# Altium schematic sheet P[11]_CPU_IO.SchDoc
size 513 x 386 mm
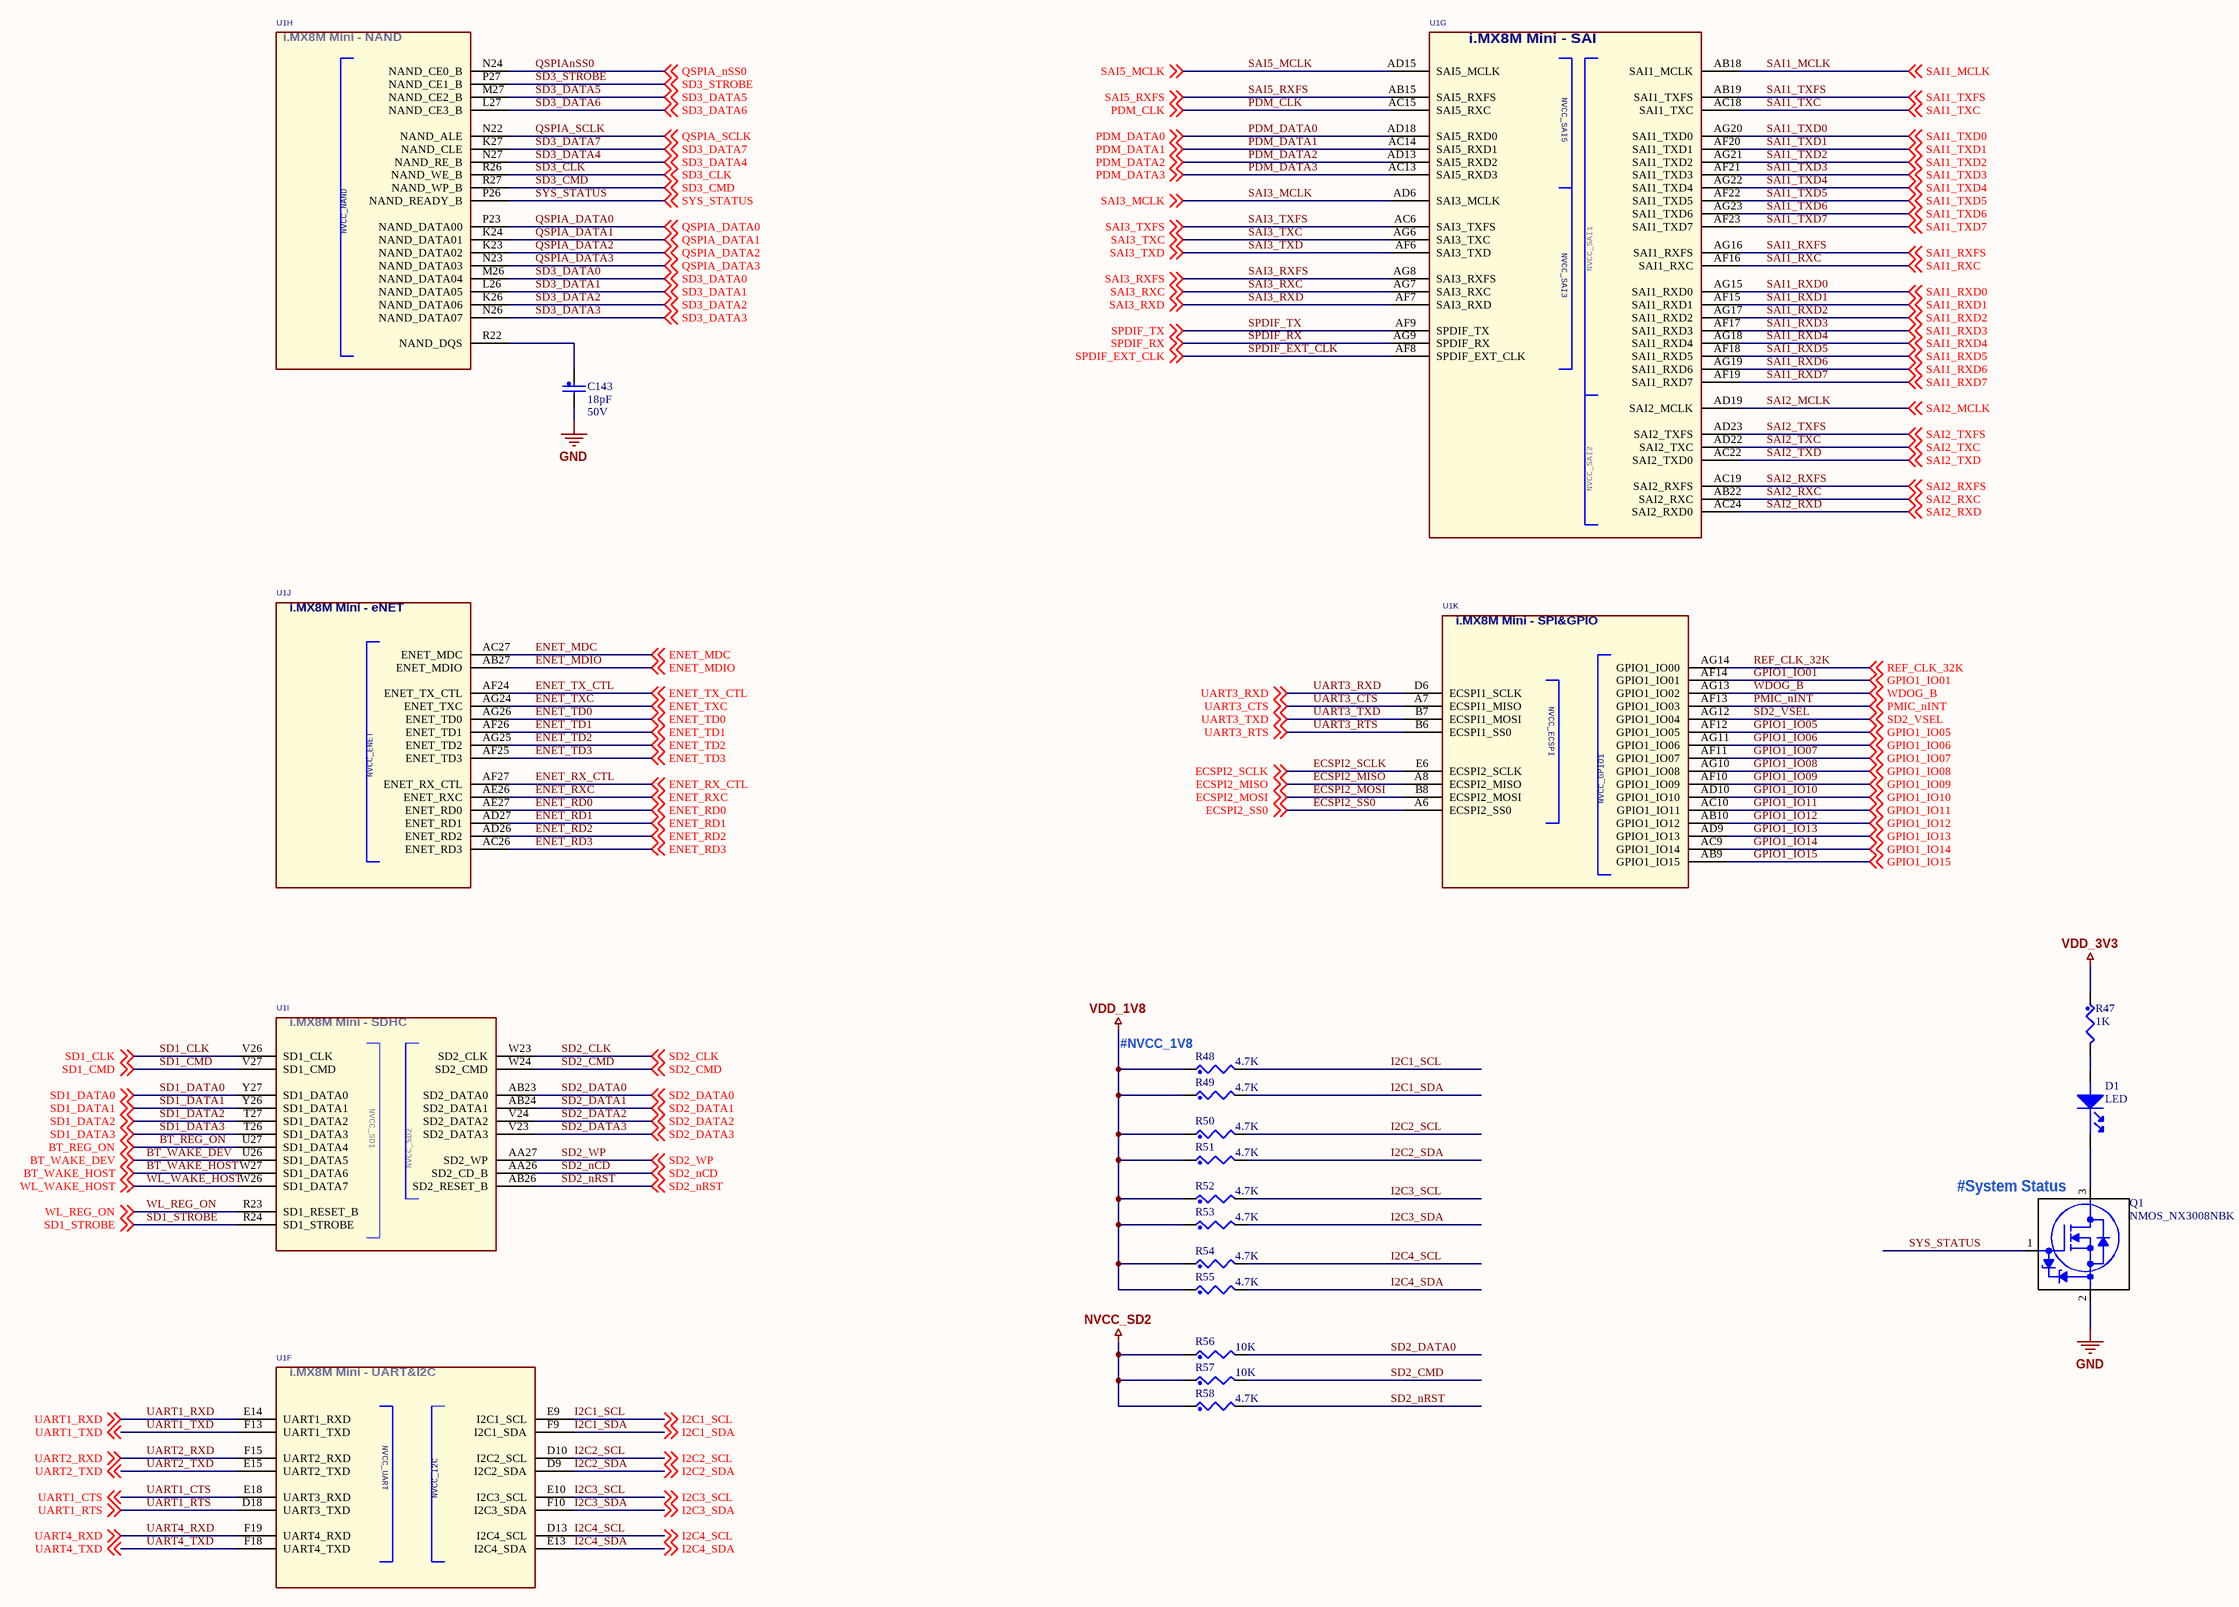
[diagram p0: P[11]_CPU_IO.SchDoc]

## Parts
C143  18pF  Voltage: 50V  [0201_CC - C]
D1  LED  [LED_0603]
Q1  NMOS_NX3008NBK  [SOT65P210X110-3N]
R47  1K  [0201_CC]
R48  4.7K  [0201_CC]
R49  4.7K  [0201_CC]
R50  4.7K  [0201_CC]
R51  4.7K  [0201_CC]
R52  4.7K  [0201_CC]
R53  4.7K  [0201_CC]
R54  4.7K  [0201_CC]
R55  4.7K  [0201_CC]
R56  10K  [0201_CC]
R57  10K  [0201_CC]
R58  4.7K  [0201_CC]
U1  (no value)  [BGA486_0P5_14X14]  (parts F,G,H,I,J,K of 14)

## Nets
GND: C143.2 Q1.2(SOURCE)
NVCC_SD2: R56.1 R57.1 R58.1
VDD_1V8: R48.1 R49.1 R50.1 R51.1 R52.1 R53.1 R54.1 R55.1
VDD_3V3: R47.1
BT_REG_ON: U1.U27(SD1_DATA4) ; off-sheet BT_REG_ON
BT_WAKE_DEV: U1.U26(SD1_DATA5) ; off-sheet BT_WAKE_DEV
BT_WAKE_HOST: U1.W27(SD1_DATA6) ; off-sheet BT_WAKE_HOST
ECSPI2_MISO: U1.A8(ECSPI2_MISO) ; off-sheet ECSPI2_MISO
ECSPI2_MOSI: U1.B8(ECSPI2_MOSI) ; off-sheet ECSPI2_MOSI
ECSPI2_SCLK: U1.E6(ECSPI2_SCLK) ; off-sheet ECSPI2_SCLK
ECSPI2_SS0: U1.A6(ECSPI2_SS0) ; off-sheet ECSPI2_SS0
ENET_MDC: U1.AC27(ENET_MDC) ; off-sheet ENET_MDC
ENET_MDIO: U1.AB27(ENET_MDIO) ; off-sheet ENET_MDIO
ENET_RD0: U1.AE27(ENET_RD0) ; off-sheet ENET_RD0
ENET_RD1: U1.AD27(ENET_RD1) ; off-sheet ENET_RD1
ENET_RD2: U1.AD26(ENET_RD2) ; off-sheet ENET_RD2
ENET_RD3: U1.AC26(ENET_RD3) ; off-sheet ENET_RD3
ENET_RX_CTL: U1.AF27(ENET_RX_CTL) ; off-sheet ENET_RX_CTL
ENET_RXC: U1.AE26(ENET_RXC) ; off-sheet ENET_RXC
ENET_TD0: U1.AG26(ENET_TD0) ; off-sheet ENET_TD0
ENET_TD1: U1.AF26(ENET_TD1) ; off-sheet ENET_TD1
ENET_TD2: U1.AG25(ENET_TD2) ; off-sheet ENET_TD2
ENET_TD3: U1.AF25(ENET_TD3) ; off-sheet ENET_TD3
ENET_TX_CTL: U1.AF24(ENET_TX_CTL) ; off-sheet ENET_TX_CTL
ENET_TXC: U1.AG24(ENET_TXC) ; off-sheet ENET_TXC
GPIO1_IO01: U1.AF14(GPIO1_IO01) ; off-sheet GPIO1_IO01
GPIO1_IO05: U1.AF12(GPIO1_IO05) ; off-sheet GPIO1_IO05
GPIO1_IO06: U1.AG11(GPIO1_IO06) ; off-sheet GPIO1_IO06
GPIO1_IO07: U1.AF11(GPIO1_IO07) ; off-sheet GPIO1_IO07
GPIO1_IO08: U1.AG10(GPIO1_IO08) ; off-sheet GPIO1_IO08
GPIO1_IO09: U1.AF10(GPIO1_IO09) ; off-sheet GPIO1_IO09
GPIO1_IO10: U1.AD10(GPIO1_IO10) ; off-sheet GPIO1_IO10
GPIO1_IO11: U1.AC10(GPIO1_IO11) ; off-sheet GPIO1_IO11
GPIO1_IO12: U1.AB10(GPIO1_IO12) ; off-sheet GPIO1_IO12
GPIO1_IO13: U1.AD9(GPIO1_IO13) ; off-sheet GPIO1_IO13
GPIO1_IO14: U1.AC9(GPIO1_IO14) ; off-sheet GPIO1_IO14
GPIO1_IO15: U1.AB9(GPIO1_IO15) ; off-sheet GPIO1_IO15
I2C1_SCL: R48.2 U1.E9(I2C1_SCL) ; off-sheet I2C1_SCL
I2C1_SDA: R49.2 U1.F9(I2C1_SDA) ; off-sheet I2C1_SDA
I2C2_SCL: R50.2 U1.D10(I2C2_SCL) ; off-sheet I2C2_SCL
I2C2_SDA: R51.2 U1.D9(I2C2_SDA) ; off-sheet I2C2_SDA
I2C3_SCL: R52.2 U1.E10(I2C3_SCL) ; off-sheet I2C3_SCL
I2C3_SDA: R53.2 U1.F10(I2C3_SDA) ; off-sheet I2C3_SDA
I2C4_SCL: R54.2 U1.D13(I2C4_SCL) ; off-sheet I2C4_SCL
I2C4_SDA: R55.2 U1.E13(I2C4_SDA) ; off-sheet I2C4_SDA
PDM_CLK: U1.AC15(SAI5_RXC) ; off-sheet PDM_CLK
PDM_DATA0: U1.AD18(SAI5_RXD0) ; off-sheet PDM_DATA0
PDM_DATA1: U1.AC14(SAI5_RXD1) ; off-sheet PDM_DATA1
PDM_DATA2: U1.AD13(SAI5_RXD2) ; off-sheet PDM_DATA2
PDM_DATA3: U1.AC13(SAI5_RXD3) ; off-sheet PDM_DATA3
PMIC_nINT: U1.AF13(GPIO1_IO03) ; off-sheet PMIC_nINT
QSPIA_DATA0: U1.P23(NAND_DATA00) ; off-sheet QSPIA_DATA0
QSPIA_DATA1: U1.K24(NAND_DATA01) ; off-sheet QSPIA_DATA1
QSPIA_DATA2: U1.K23(NAND_DATA02) ; off-sheet QSPIA_DATA2
QSPIA_DATA3: U1.N23(NAND_DATA03) ; off-sheet QSPIA_DATA3
QSPIA_SCLK: U1.N22(NAND_ALE) ; off-sheet QSPIA_SCLK
QSPIAnSS0: U1.N24(NAND_CE0_B) ; off-sheet QSPIA_nSS0  [also labelled QSPIA_nSS0]
REF_CLK_32K: U1.AG14(GPIO1_IO00) ; off-sheet REF_CLK_32K
SAI1_MCLK: U1.AB18(SAI1_MCLK) ; off-sheet SAI1_MCLK
SAI1_RXC: U1.AF16(SAI1_RXC) ; off-sheet SAI1_RXC
SAI1_RXD0: U1.AG15(SAI1_RXD0) ; off-sheet SAI1_RXD0
SAI1_RXD1: U1.AF15(SAI1_RXD1) ; off-sheet SAI1_RXD1
SAI1_RXD2: U1.AG17(SAI1_RXD2) ; off-sheet SAI1_RXD2
SAI1_RXD3: U1.AF17(SAI1_RXD3) ; off-sheet SAI1_RXD3
SAI1_RXD4: U1.AG18(SAI1_RXD4) ; off-sheet SAI1_RXD4
SAI1_RXD5: U1.AF18(SAI1_RXD5) ; off-sheet SAI1_RXD5
SAI1_RXD6: U1.AG19(SAI1_RXD6) ; off-sheet SAI1_RXD6
SAI1_RXD7: U1.AF19(SAI1_RXD7) ; off-sheet SAI1_RXD7
SAI1_RXFS: U1.AG16(SAI1_RXFS) ; off-sheet SAI1_RXFS
SAI1_TXC: U1.AC18(SAI1_TXC) ; off-sheet SAI1_TXC
SAI1_TXD0: U1.AG20(SAI1_TXD0) ; off-sheet SAI1_TXD0
SAI1_TXD1: U1.AF20(SAI1_TXD1) ; off-sheet SAI1_TXD1
SAI1_TXD2: U1.AG21(SAI1_TXD2) ; off-sheet SAI1_TXD2
SAI1_TXD3: U1.AF21(SAI1_TXD3) ; off-sheet SAI1_TXD3
SAI1_TXD4: U1.AG22(SAI1_TXD4) ; off-sheet SAI1_TXD4
SAI1_TXD5: U1.AF22(SAI1_TXD5) ; off-sheet SAI1_TXD5
SAI1_TXD6: U1.AG23(SAI1_TXD6) ; off-sheet SAI1_TXD6
SAI1_TXD7: U1.AF23(SAI1_TXD7) ; off-sheet SAI1_TXD7
SAI1_TXFS: U1.AB19(SAI1_TXFS) ; off-sheet SAI1_TXFS
SAI2_MCLK: U1.AD19(SAI2_MCLK) ; off-sheet SAI2_MCLK
SAI2_RXC: U1.AB22(SAI2_RXC) ; off-sheet SAI2_RXC
SAI2_RXD: U1.AC24(SAI2_RXD0) ; off-sheet SAI2_RXD
SAI2_RXFS: U1.AC19(SAI2_RXFS) ; off-sheet SAI2_RXFS
SAI2_TXC: U1.AD22(SAI2_TXC) ; off-sheet SAI2_TXC
SAI2_TXD: U1.AC22(SAI2_TXD0) ; off-sheet SAI2_TXD
SAI2_TXFS: U1.AD23(SAI2_TXFS) ; off-sheet SAI2_TXFS
SAI3_MCLK: U1.AD6(SAI3_MCLK) ; off-sheet SAI3_MCLK
SAI3_RXC: U1.AG7(SAI3_RXC) ; off-sheet SAI3_RXC
SAI3_RXD: U1.AF7(SAI3_RXD) ; off-sheet SAI3_RXD
SAI3_RXFS: U1.AG8(SAI3_RXFS) ; off-sheet SAI3_RXFS
SAI3_TXC: U1.AG6(SAI3_TXC) ; off-sheet SAI3_TXC
SAI3_TXD: U1.AF6(SAI3_TXD) ; off-sheet SAI3_TXD
SAI3_TXFS: U1.AC6(SAI3_TXFS) ; off-sheet SAI3_TXFS
SAI5_MCLK: U1.AD15(SAI5_MCLK) ; off-sheet SAI5_MCLK
SAI5_RXFS: U1.AB15(SAI5_RXFS) ; off-sheet SAI5_RXFS
SD1_CLK: U1.V26(SD1_CLK) ; off-sheet SD1_CLK
SD1_CMD: U1.V27(SD1_CMD) ; off-sheet SD1_CMD
SD1_DATA0: U1.Y27(SD1_DATA0) ; off-sheet SD1_DATA0
SD1_DATA1: U1.Y26(SD1_DATA1) ; off-sheet SD1_DATA1
SD1_DATA2: U1.T27(SD1_DATA2) ; off-sheet SD1_DATA2
SD1_DATA3: U1.T26(SD1_DATA3) ; off-sheet SD1_DATA3
SD1_STROBE: U1.R24(SD1_STROBE) ; off-sheet SD1_STROBE
SD2_CLK: U1.W23(SD2_CLK) ; off-sheet SD2_CLK
SD2_CMD: R57.2 U1.W24(SD2_CMD) ; off-sheet SD2_CMD
SD2_DATA0: R56.2 U1.AB23(SD2_DATA0) ; off-sheet SD2_DATA0
SD2_DATA1: U1.AB24(SD2_DATA1) ; off-sheet SD2_DATA1
SD2_DATA2: U1.V24(SD2_DATA2) ; off-sheet SD2_DATA2
SD2_DATA3: U1.V23(SD2_DATA3) ; off-sheet SD2_DATA3
SD2_nCD: U1.AA26(SD2_CD_B) ; off-sheet SD2_nCD
SD2_nRST: R58.2 U1.AB26(SD2_RESET_B) ; off-sheet SD2_nRST
SD2_VSEL: U1.AG12(GPIO1_IO04) ; off-sheet SD2_VSEL
SD2_WP: U1.AA27(SD2_WP) ; off-sheet SD2_WP
SD3_CLK: U1.R26(NAND_WE_B) ; off-sheet SD3_CLK
SD3_CMD: U1.R27(NAND_WP_B) ; off-sheet SD3_CMD
SD3_DATA0: U1.M26(NAND_DATA04) ; off-sheet SD3_DATA0
SD3_DATA1: U1.L26(NAND_DATA05) ; off-sheet SD3_DATA1
SD3_DATA2: U1.K26(NAND_DATA06) ; off-sheet SD3_DATA2
SD3_DATA3: U1.N26(NAND_DATA07) ; off-sheet SD3_DATA3
SD3_DATA4: U1.N27(NAND_RE_B) ; off-sheet SD3_DATA4
SD3_DATA5: U1.M27(NAND_CE2_B) ; off-sheet SD3_DATA5
SD3_DATA6: U1.L27(NAND_CE3_B) ; off-sheet SD3_DATA6
SD3_DATA7: U1.K27(NAND_CLE) ; off-sheet SD3_DATA7
SD3_STROBE: U1.P27(NAND_CE1_B) ; off-sheet SD3_STROBE
SPDIF_EXT_CLK: U1.AF8(SPDIF_EXT_CLK) ; off-sheet SPDIF_EXT_CLK
SPDIF_RX: U1.AG9(SPDIF_RX) ; off-sheet SPDIF_RX
SPDIF_TX: U1.AF9(SPDIF_TX) ; off-sheet SPDIF_TX
SYS_STATUS: Q1.1(GATE) U1.P26(NAND_READY_B) ; off-sheet SYS_STATUS
UART1_CTS: U1.E18(UART3_RXD) ; off-sheet UART1_CTS
UART1_RTS: U1.D18(UART3_TXD) ; off-sheet UART1_RTS
UART1_RXD: U1.E14(UART1_RXD) ; off-sheet UART1_RXD
UART1_TXD: U1.F13(UART1_TXD) ; off-sheet UART1_TXD
UART2_RXD: U1.F15(UART2_RXD) ; off-sheet UART2_RXD
UART2_TXD: U1.E15(UART2_TXD) ; off-sheet UART2_TXD
UART3_CTS: U1.A7(ECSPI1_MISO) ; off-sheet UART3_CTS
UART3_RTS: U1.B6(ECSPI1_SS0) ; off-sheet UART3_RTS
UART3_RXD: U1.D6(ECSPI1_SCLK) ; off-sheet UART3_RXD
UART3_TXD: U1.B7(ECSPI1_MOSI) ; off-sheet UART3_TXD
UART4_RXD: U1.F19(UART4_RXD) ; off-sheet UART4_RXD
UART4_TXD: U1.F18(UART4_TXD) ; off-sheet UART4_TXD
WDOG_B: U1.AG13(GPIO1_IO02) ; off-sheet WDOG_B
WL_REG_ON: U1.R23(SD1_RESET_B) ; off-sheet WL_REG_ON
WL_WAKE_HOST: U1.W26(SD1_DATA7) ; off-sheet WL_WAKE_HOST
NetC143_1: C143.1 U1.R22(NAND_DQS)
NetD1_A: D1.A(ANODE) R47.2
NetD1_C: D1.C(CATHODE) Q1.3(DRAIN)

## Notes on the sheet
- (near R48) #NVCC_1V8
- (near Q1) #System Status
- (in symbol MIMX8MM_BGA486P, part F) i.MX8M Mini - UART&I2C
- (in symbol MIMX8MM_BGA486P, part G) i.MX8M Mini - SAI
- (in symbol MIMX8MM_BGA486P, part H) i.MX8M Mini - NAND
- (in symbol MIMX8MM_BGA486P, part I) i.MX8M Mini - SDHC
- (in symbol MIMX8MM_BGA486P, part J) i.MX8M Mini - eNET
- (in symbol MIMX8MM_BGA486P, part K) i.MX8M Mini - SPI&GPIO

## Library data of the parts
C143 = CAP_NP: CLASS: DISCRETE
D1 = LED: CLASS: IC
Q1 = NMOS_NX3008NBK: NMOS_NX3008NBK\AAR; CLASS: IC
R47-R58 = RES: CLASS: DISCRETE
U1 = MIMX8MM_BGA486P: IC CPU QUAD CORTEX A53+M4 1.8GHZ BGA486 / By Arman Arvand; SPLIT_INST: TRUE; CAD_APPROVED: Yes; PRE_APN: 330-77072; MFG_PN01: MIMX8MM6DVTLZAA; MFG_NAME01: NXP SEMICONDUCTORS; AGILE_PN: TMP-WF-32905; CLASS: IC; HEIGHT: 1.25MM; ROHS: Yes